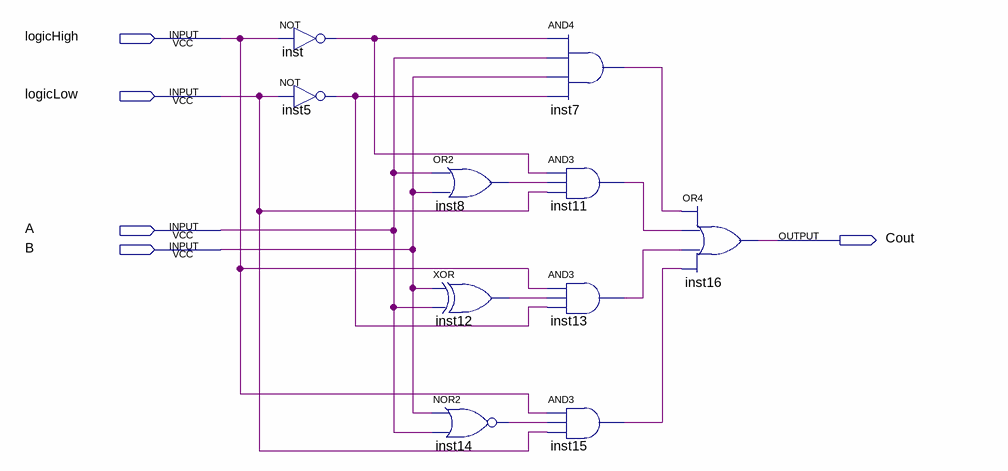
[diagram p0: schematic sheet]
// Quartus schematic logic.bdf as structural Verilog: 10 symbols, 5 pins
module \logic  (
  input  logicHigh,
  input  logicLow,
  input  A,
  input  B,
  output Cout
);

  wire inst5_out, inst7_out, inst8_out, inst11_out, inst12_out, inst13_out, inst14_out, inst15_out, inst_out;

  not inst (inst_out, logicHigh);
  not inst5 (inst5_out, logicLow);
  or inst8 (inst8_out, A, B);
  xor inst12 (inst12_out, B, A);
  nor inst14 (inst14_out, B, A);
  and inst7 (inst7_out, inst_out, A, B, inst5_out);
  and inst11 (inst11_out, inst_out, inst8_out, logicLow);
  and inst13 (inst13_out, logicHigh, inst12_out, inst5_out);
  and inst15 (inst15_out, logicHigh, inst14_out, logicLow);
  or inst16 (Cout, inst7_out, inst11_out, inst13_out, inst15_out);
endmodule
